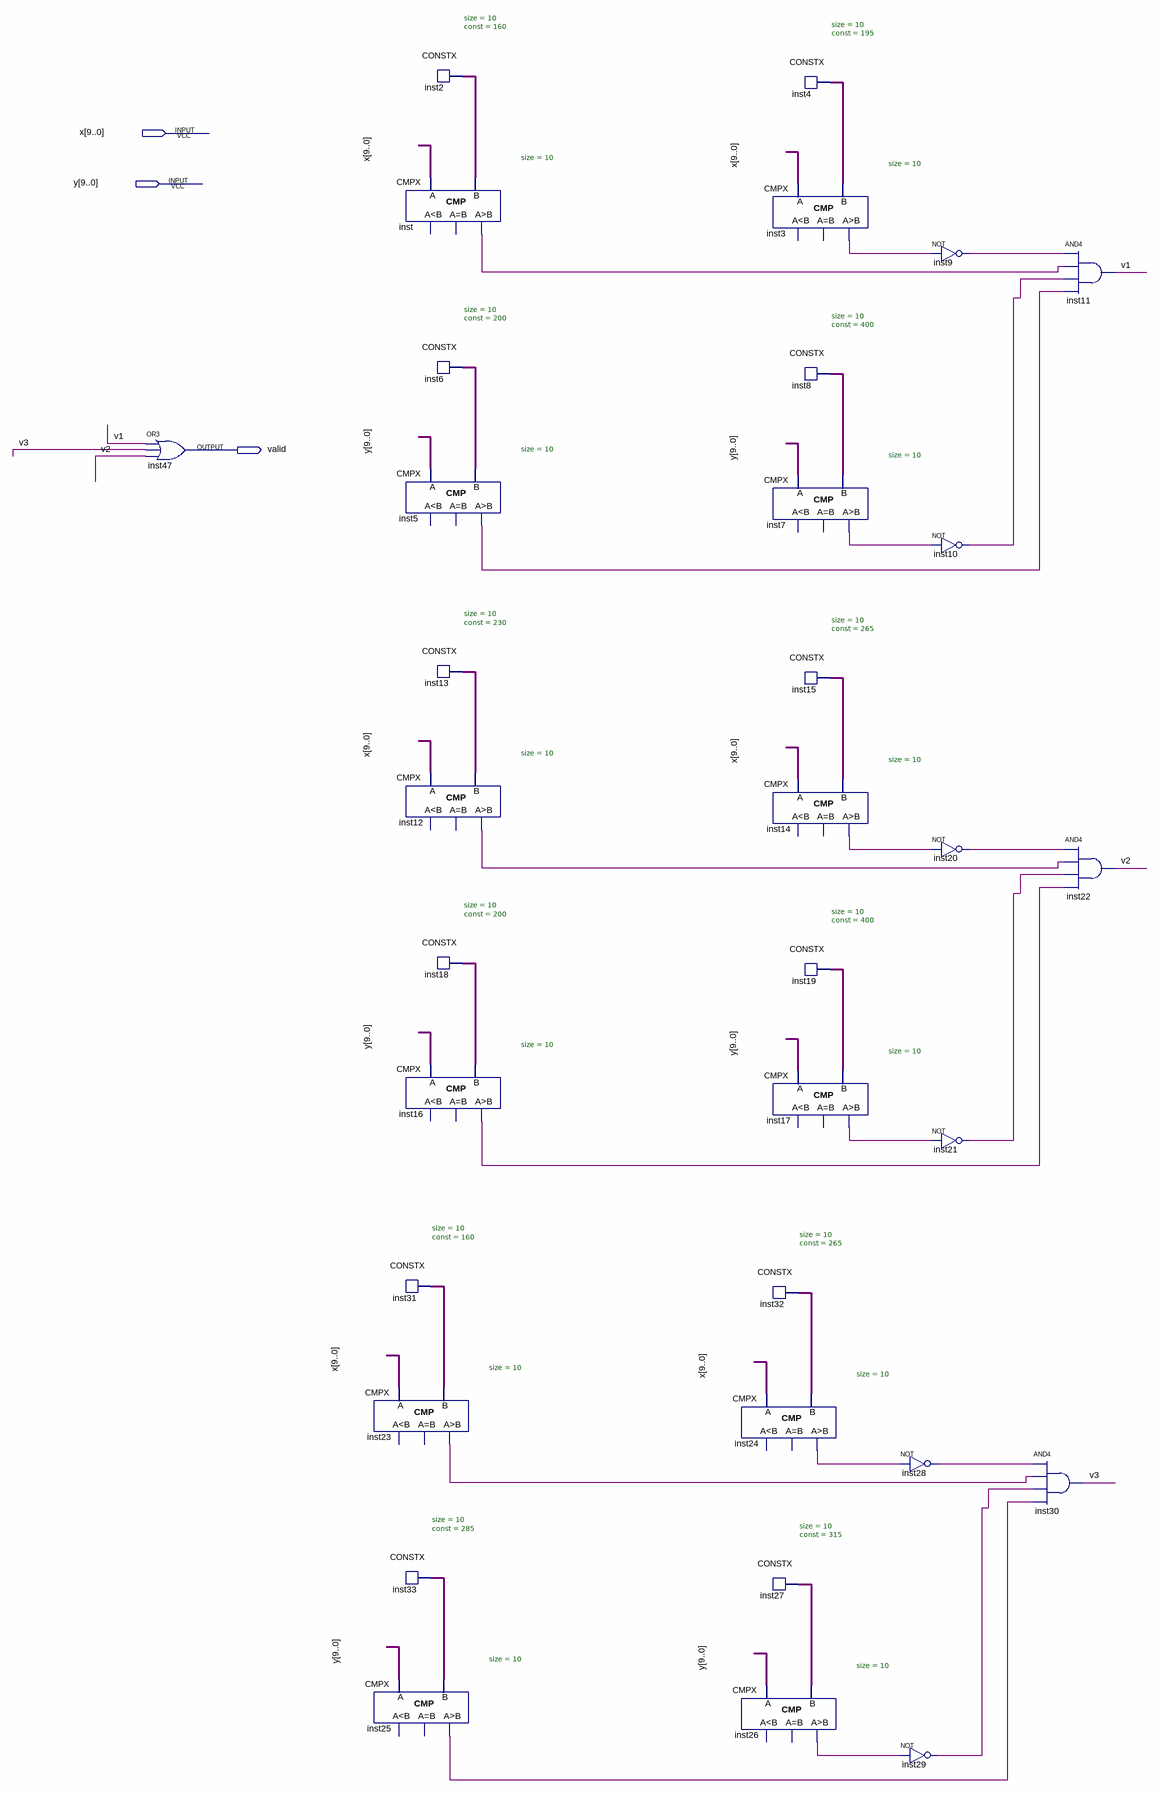
[diagram p0: schematic sheet]
// Quartus schematic slovoN.bdf as structural Verilog: 34 symbols, 3 pins
module slovoN (
  input  [9:0] x,
  input  [9:0] y,
  output valid
);

  wire inst3_gr, inst5_gr, inst7_gr, inst9_out, inst10_out, inst12_gr, inst14_gr, inst16_gr, inst17_gr,
       inst20_out, inst21_out, inst23_gr, inst24_gr, inst25_gr, inst26_gr, inst28_out, inst29_out, inst_gr,
       v1, v2, v3;
  wire [9:0] inst2_data, inst4_data, inst6_data, inst8_data, inst13_data, inst15_data, inst18_data,
       inst19_data, inst27_data, inst31_data, inst32_data, inst33_data;

  or inst47 (valid, v1, v3, v2);
  CMPX #(.size(10)) inst (.A(x), .B(inst2_data), .gr(inst_gr));  // open: ls, eq
  CMPX #(.size(10)) inst5 (.A(y), .B(inst6_data), .gr(inst5_gr));  // open: ls, eq
  CMPX #(.size(10)) inst12 (.A(x), .B(inst13_data), .gr(inst12_gr));  // open: ls, eq
  CMPX #(.size(10)) inst16 (.A(y), .B(inst18_data), .gr(inst16_gr));  // open: ls, eq
  CONSTX #(.size(10), .\const (160)) inst31 (.data(inst31_data));
  CMPX #(.size(10)) inst23 (.A(x), .B(inst31_data), .gr(inst23_gr));  // open: ls, eq
  CONSTX #(.size(10), .\const (285)) inst33 (.data(inst33_data));
  CMPX #(.size(10)) inst25 (.A(y), .B(inst33_data), .gr(inst25_gr));  // open: ls, eq
  CONSTX #(.size(10), .\const (160)) inst2 (.data(inst2_data));
  CONSTX #(.size(10), .\const (200)) inst6 (.data(inst6_data));
  CONSTX #(.size(10), .\const (230)) inst13 (.data(inst13_data));
  CONSTX #(.size(10), .\const (200)) inst18 (.data(inst18_data));
  CMPX #(.size(10)) inst3 (.A(x), .B(inst4_data), .gr(inst3_gr));  // open: ls, eq
  CMPX #(.size(10)) inst7 (.A(y), .B(inst8_data), .gr(inst7_gr));  // open: ls, eq
  CMPX #(.size(10)) inst14 (.A(x), .B(inst15_data), .gr(inst14_gr));  // open: ls, eq
  CMPX #(.size(10)) inst17 (.A(y), .B(inst19_data), .gr(inst17_gr));  // open: ls, eq
  CONSTX #(.size(10), .\const (265)) inst32 (.data(inst32_data));
  CMPX #(.size(10)) inst24 (.A(x), .B(inst32_data), .gr(inst24_gr));  // open: ls, eq
  CONSTX #(.size(10), .\const (315)) inst27 (.data(inst27_data));
  CMPX #(.size(10)) inst26 (.A(y), .B(inst27_data), .gr(inst26_gr));  // open: ls, eq
  CONSTX #(.size(10), .\const (195)) inst4 (.data(inst4_data));
  CONSTX #(.size(10), .\const (400)) inst8 (.data(inst8_data));
  CONSTX #(.size(10), .\const (265)) inst15 (.data(inst15_data));
  CONSTX #(.size(10), .\const (400)) inst19 (.data(inst19_data));
  not inst28 (inst28_out, inst24_gr);
  not inst29 (inst29_out, inst26_gr);
  not inst9 (inst9_out, inst3_gr);
  not inst10 (inst10_out, inst7_gr);
  not inst20 (inst20_out, inst14_gr);
  not inst21 (inst21_out, inst17_gr);
  and inst11 (v1, inst9_out, inst_gr, inst10_out, inst5_gr);
  and inst22 (v2, inst20_out, inst12_gr, inst21_out, inst16_gr);
  and inst30 (v3, inst28_out, inst23_gr, inst29_out, inst25_gr);
endmodule
